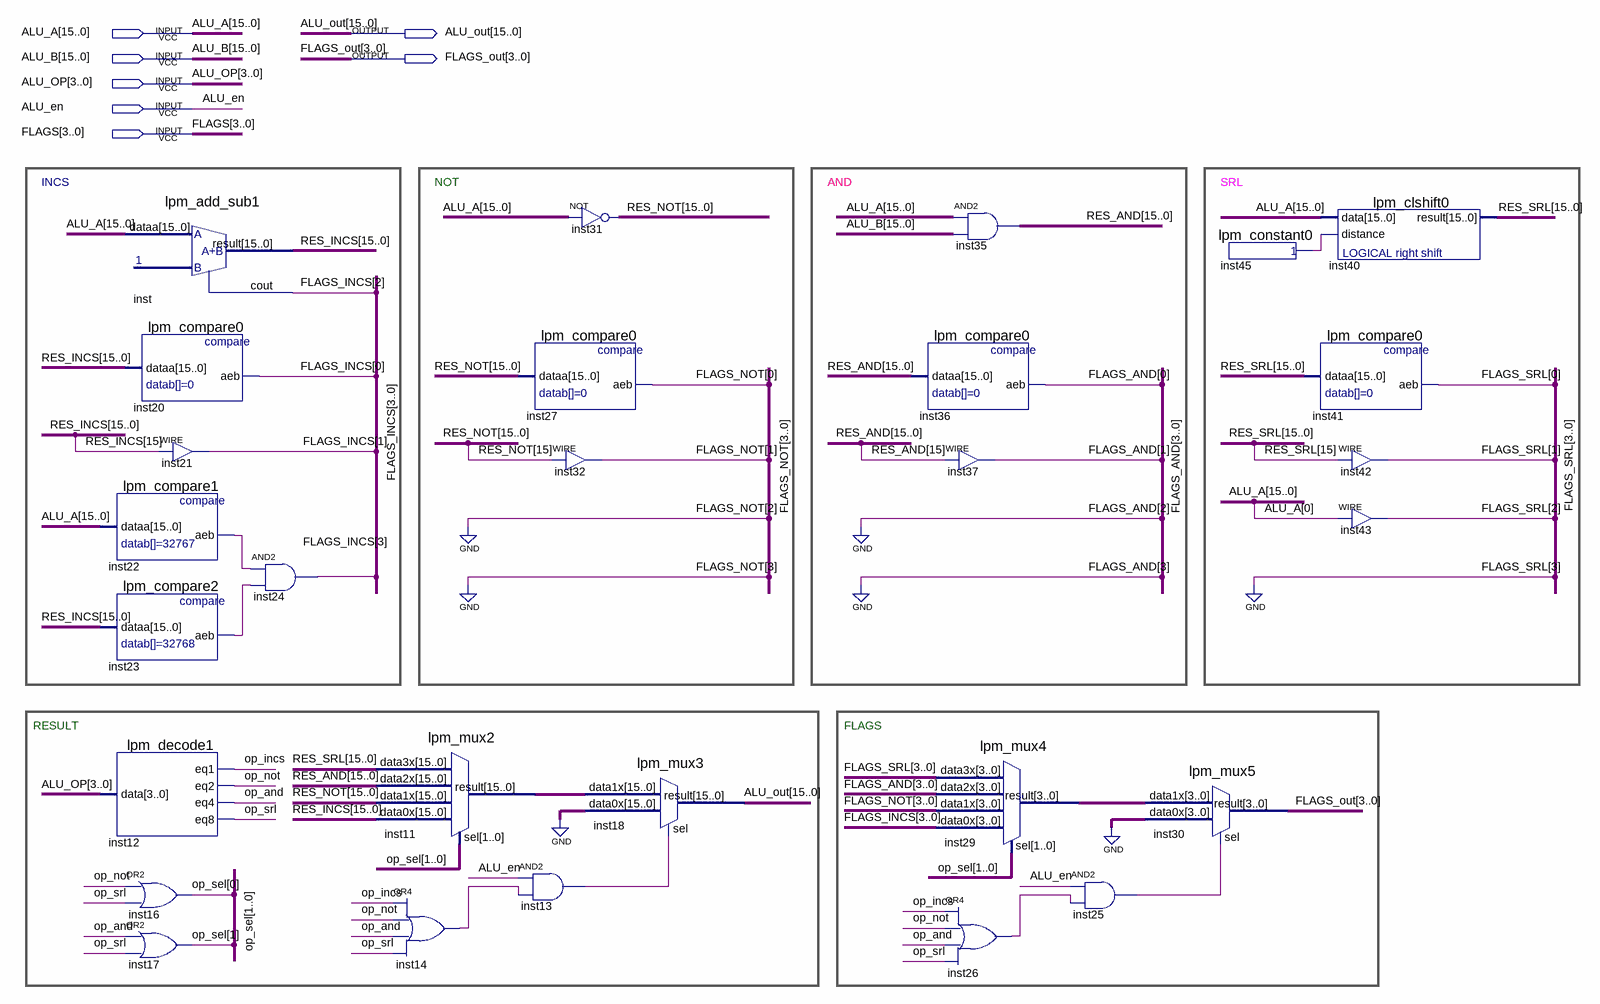
[diagram p0: schematic sheet]
// Quartus schematic ALU.bdf as structural Verilog: 28 symbols, 7 pins
module ALU (
  input  [15:0] ALU_A,
  input  [15:0] ALU_B,
  input  [3:0] ALU_OP,
  input  ALU_en,
  input  [3:0] FLAGS,
  output [15:0] ALU_out,
  output [3:0] FLAGS_out
);

  wire inst13_out, inst14_out, inst22_aeb, inst23_aeb, inst25_out, inst26_out, inst45_result, op_and,
       op_incs, op_not, op_srl;
  wire [1:0] FLAGS_AND, FLAGS_NOT, op_sel;
  wire [2:0] FLAGS_SRL;
  wire [3:0] FLAGS_INCS, inst29_result;
  wire [15:0] inst11_result, RES_AND, RES_INCS, RES_NOT, RES_SRL;

  lpm_compare1 inst22 (.dataa(ALU_A), .aeb(inst22_aeb));
  lpm_compare2 inst23 (.dataa(RES_INCS), .aeb(inst23_aeb));
  lpm_decode1 inst12 (.data(ALU_OP), .eq1(op_incs), .eq2(op_not), .eq4(op_and), .eq8(op_srl));
  lpm_add_sub1 inst (.dataa(ALU_A), .result(RES_INCS), .cout(FLAGS_INCS[2]));
  lpm_compare0 inst20 (.dataa(RES_INCS), .aeb(FLAGS_INCS[0]));
  assign FLAGS_INCS[1] = RES_INCS[15];  // WIRE inst21
  or inst16 (op_sel[0], op_not, op_srl);
  or inst17 (op_sel[1], op_and, op_srl);
  and inst24 (FLAGS_INCS[3], inst22_aeb, inst23_aeb);
  lpm_mux2 inst11 (
    .data3x(RES_SRL), .data2x(RES_AND), .data1x(RES_NOT), .data0x(RES_INCS), .sel(op_sel),
    .result(inst11_result));
  or inst14 (inst14_out, op_incs, op_not, op_and, op_srl);
  lpm_compare0 inst27 (.dataa(RES_NOT), .aeb(FLAGS_NOT[0]));
  and inst13 (inst13_out, ALU_en, inst14_out);
  assign RES_NOT = ~ALU_A;  // NOT inst31, 16 bits wide
  assign FLAGS_NOT[1] = RES_NOT[15];  // WIRE inst32
  lpm_mux3 inst18 (.data1x(inst11_result), .data0x({16{1'b0}}), .sel(inst13_out), .result(ALU_out));
  lpm_compare0 inst36 (.dataa(RES_AND), .aeb(FLAGS_AND[0]));
  assign RES_AND = ALU_A & ALU_B;  // AND2 inst35, 16 bits wide
  assign FLAGS_AND[1] = RES_AND[15];  // WIRE inst37
  lpm_mux4 inst29 (
    .data3x({1'b0, FLAGS_SRL}), .data2x({2'b00, FLAGS_AND}), .data1x({2'b00, FLAGS_NOT}),
    .data0x(FLAGS_INCS), .sel(op_sel), .result(inst29_result));
  or inst26 (inst26_out, op_incs, op_not, op_and, op_srl);
  and inst25 (inst25_out, ALU_en, inst26_out);
  lpm_mux5 inst30 (.data1x(inst29_result), .data0x(4'b0000), .sel(inst25_out), .result(FLAGS_out));
  lpm_constant0 inst45 (.result(inst45_result));
  lpm_clshift0 inst40 (.data(ALU_A), .distance(inst45_result), .result(RES_SRL));
  lpm_compare0 inst41 (.dataa(RES_SRL), .aeb(FLAGS_SRL[0]));
  assign FLAGS_SRL[1] = RES_SRL[15];  // WIRE inst42
  assign FLAGS_SRL[2] = ALU_A[0];  // WIRE inst43

  // Notes on the sheet:
  //   INCS
  //   NOT
  //   AND
  //   SRL
  //   RESULT
  //   FLAGS
endmodule
